# Altium schematic sheet Temperature_Sensor_0_new.SchDoc
size A; SheetNumber: 1; SheetTotal: 1
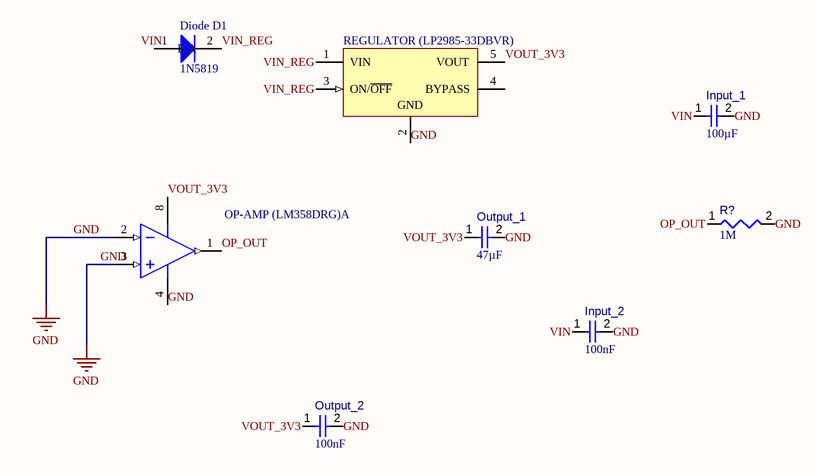
[diagram p0: Temperature_Sensor_0_new.SchDoc]

## Parts
Diode_D1  1N5819  [ONSC-AXIAL_LEAD-2-59-10_P]
Input_1  value 100µF  [CAPC0805(2012)145_L]  (hidden comment: Capacitor 100µF +/-20% 6.3V 0805)
Input_2  value 100nF  [CAPC1005X56X25LL10T15]  (hidden comment: Capacitor 0.1 uF +/- 5% 16 V 0402)
OP-AMP_(LM358DRG)  (no value)  [ONSC-SOIC-8-751-07_V]  (part A of 2)
Output_1  value 47µF  [CAPC0805(2012)145_L]  (hidden comment: Capacitor 47µF +/-40% 6.3V 0805)
Output_2  value 100nF  [CAPC1005X56X25LL10T15]  (hidden comment: Capacitor 0.1 uF +/- 5% 16 V 0402)
R?  value 1M  [RESA60-630X240]  (hidden comment: MFR-25FBF52-1M)
REGULATOR_(LP2985-33DBVR)  (no value)  [TI-DBV5_V]

## Nets
GND: Input_1.2 Input_2.2 OP-AMP_(LM358DRG).2(INA-) OP-AMP_(LM358DRG).3(INA+) OP-AMP_(LM358DRG).4(VEE/GND) Output_1.2 Output_2.2 R?.2 REGULATOR_(LP2985-33DBVR).2(GND)
OP_OUT: OP-AMP_(LM358DRG).1(OUTA) R?.1
VIN: Input_1.1 Input_2.1
VIN_REG: Diode_D1.2(K) REGULATOR_(LP2985-33DBVR).1(VIN) REGULATOR_(LP2985-33DBVR).3(ON/~{OFF})
VOUT_3V3: OP-AMP_(LM358DRG).8(VCC) Output_1.1 Output_2.1 REGULATOR_(LP2985-33DBVR).5(VOUT)

Not connected (* = marked no-connect by the designer): Diode_D1 1(A); REGULATOR_(LP2985-33DBVR) 4(BYPASS)

## Notes on the sheet
- Labels drawn without touching a wire or pin: VIN

## Library data of the parts
Diode_D1 = CMP-004-00009-2: Low Drop Power Schottky Rectifier, 40 V, 1 A, 2-Pin DO-41, RoHS; Manufacturer: ON Semiconductor; Max Surge Current: 25A; Forward Current: 1A; Package Version: Rev. U, 02/2005; Peak Reverse Current: 1mA; Max Operating Temperature: 125°C; Case/Package: DO; Package URL: http://www.onsemi.cn/pub_link/Collateral/59-10.PDF; Packaging: Bulk; Manufacturer URL: http://www.onsemi.com/; Min Operating Temperature: -65°C; Package Description: 2-Pin, Axial Lead, Diameter 2.35 mm; Mounting Technology: TH; Datasheet URL: http://www.onsemi.cn/pub_link/Collateral/1N5817-D.PDF; Datasheet Version: Rev. 10, 07/2006; Package Reference: AXIAL_LEAD-2-59-10; Pins: 2; RoHS Compliant: True
Input_1 = CMP-001-00054-4: Chip Capacitor, 100µF +/-20%, 6.3V, 0805, Thickness 1.45 mm; Tolerance: 10%; Min Operating Temperature: -55°C; Max Operating Temperature: 85°C; Pins: 2; Mounting Technology: SMT; Case/Package: 0805; Voltage Rating: 6.3V
Input_2 Output_2 = CMP-001-00001-6: Chip Capacitor, 0.1 uF, +/- 5%, 16 V, 0402 (1005 Metric); Capacitor Type: Ceramic; Voltage Rating: 16V; Max Operating Temperature: 125°C; Min Operating Temperature: -55°C; Case/Package: 0402; Mounting Technology: SM; Pins: 2; Tolerance: 5%; RoHS Compliant: True
OP-AMP_(LM358DRG) = CMP-014-00017-2: Single Supply Dual Operational Amplifier, 3 to 32 V, 0 to 70 degC, 8-Pin SOIC, Pb-Free, Tape and Reel; Manufacturer: ON Semiconductor; Max Supply Voltage: 44V; Max Input Voltage: 28.3V; Nominal Voltage Gain: 100dB; Slew Rate: 0.07V/us; Common Mode Rejection Ratio: 65dB; Nominal Supply Voltage: 12V; Min Supply Voltage: 2.3V; Channels: 2; Max Dual Supply Voltage: 16V; Nominal Supply Current: 35uA; Output Current: 40mA; Min Dual Supply Voltage: 1.5V; Nominal Gain Bandwith Product: 200KHz; Min Input Voltage: 0uV; Package Reference: SOIC-8-751-07; Package Description: 8-Pin Small Outline Integrated Circuit, Body 4.9 x 3.9 mm, Pitch 1.27 mm; Min Operating Temperature: 0°C; Max Operating Temperature: 70°C; Case/Package: SOIC; Datasheet URL: http://www.onsemi.cn/pub_link/Collateral/LM358-D.PDF; Manufacturer URL: http://www.onsemi.com/; Packaging: TapeandReel; Pins: 8; RoHS Compliant: True; Datasheet Version: Rev. 32, 10/2016; Package Quantity: 2500; Nominal Dual Supply Voltage: 12V; Mounting Technology: SM
Output_1 = CMP-001-00082-4: Chip Capacitor, 47µF +/-40%, 6.3V, 0805, Thickness 1.45 mm; Tolerance: 10%; Min Operating Temperature: -55°C; Max Operating Temperature: 85°C; Case/Package: 0805; Pins: 2; Mounting Technology: SMT; Voltage Rating: 6.3V
R? = CMP-009-00049-4: Axial Resistor, 1 MOhm, +/- 1%, 250 mW, -55 to 155 degC, 2-Pin THD, RoHS, Bulk; Manufacturer: Yageo; Voltage Rating: 250V; Power: 250mW; Datasheet Version: Apr-13; Package Reference: MFR-25; Package Quantity: 200; Min Operating Temperature: -55°C; RoHS Compliant: True; Mounting Technology: TH; Datasheet URL: http://www.yageo.com/documents/recent/Yageo%20LR_MFR_2013.pdf; Max Operating Temperature: 155°C; Package Description: 2-Pin Axial Lead, Dia 2.4 mm, Body Length 6.3 mm; Packaging: Bulk; Tolerance: 1%; Case/Package: Axial; Manufacturer URL: http://www.yageo.com/
REGULATOR_(LP2985-33DBVR) = CMP-019-00026-3: Single Output Low Noise LDO, 150 mA, Fixed 3.3 V Output, 1.5% Tolerance, 2.2 to 16 V Input, Low IQ, 5-Pin SOT-23 (DBV), -40 to 125 degC, Green (RoHS & no Sb/Br), Tape and Reel; Manufacturer: Texas Instruments; Output Current: 150mA; Package Version: 4073253-4/N, 12/2014; Outputs: 1; Dropout Voltage: 3mV; Output Voltage: 3.3V; Max Input Voltage: 16V; Min Input Voltage: 2.2V; Package Description: 5-Pin Small Outline Transistor, Body 2.9 x 1.6 mm, Pitch 0.95 mm; Mounting Technology: SM; Min Operating Temperature: -40°C; Case/Package: SOT-23-5; Datasheet Version: SLVS522O, 01/2015; Package Reference: DBV5; Max Ouput Current: 150mA; Max Operating Temperature: 125°C; RoHS Compliant: True; Packaging: TapeandReel; Nominal Output Voltage: 3.3V; Package Quantity: 3000; Package URL: http://www.ti.com/lit/ml/mpds018l/mpds018l.pdf; Pins: 16; Manufacturer URL: http://www.ti.com/; Datasheet URL: http://www.ti.com/lit/ds/symlink/lp2985.pdf